# Altium schematic sheet SH6 - LOAD MONITORING 1.SchDoc: Load Monitoring 1
size B; CheckedBy: Lance Bantoto; Engineer: Cindy Li; Organization: UW Robotics; Address1: 200 University Avenue; Address2: Waterloo; Address3: Ontario; Address4: Canada N2L 3G6; DocumentNumber: 6; Revision: 2; SheetNumber: 6; SheetTotal: 10
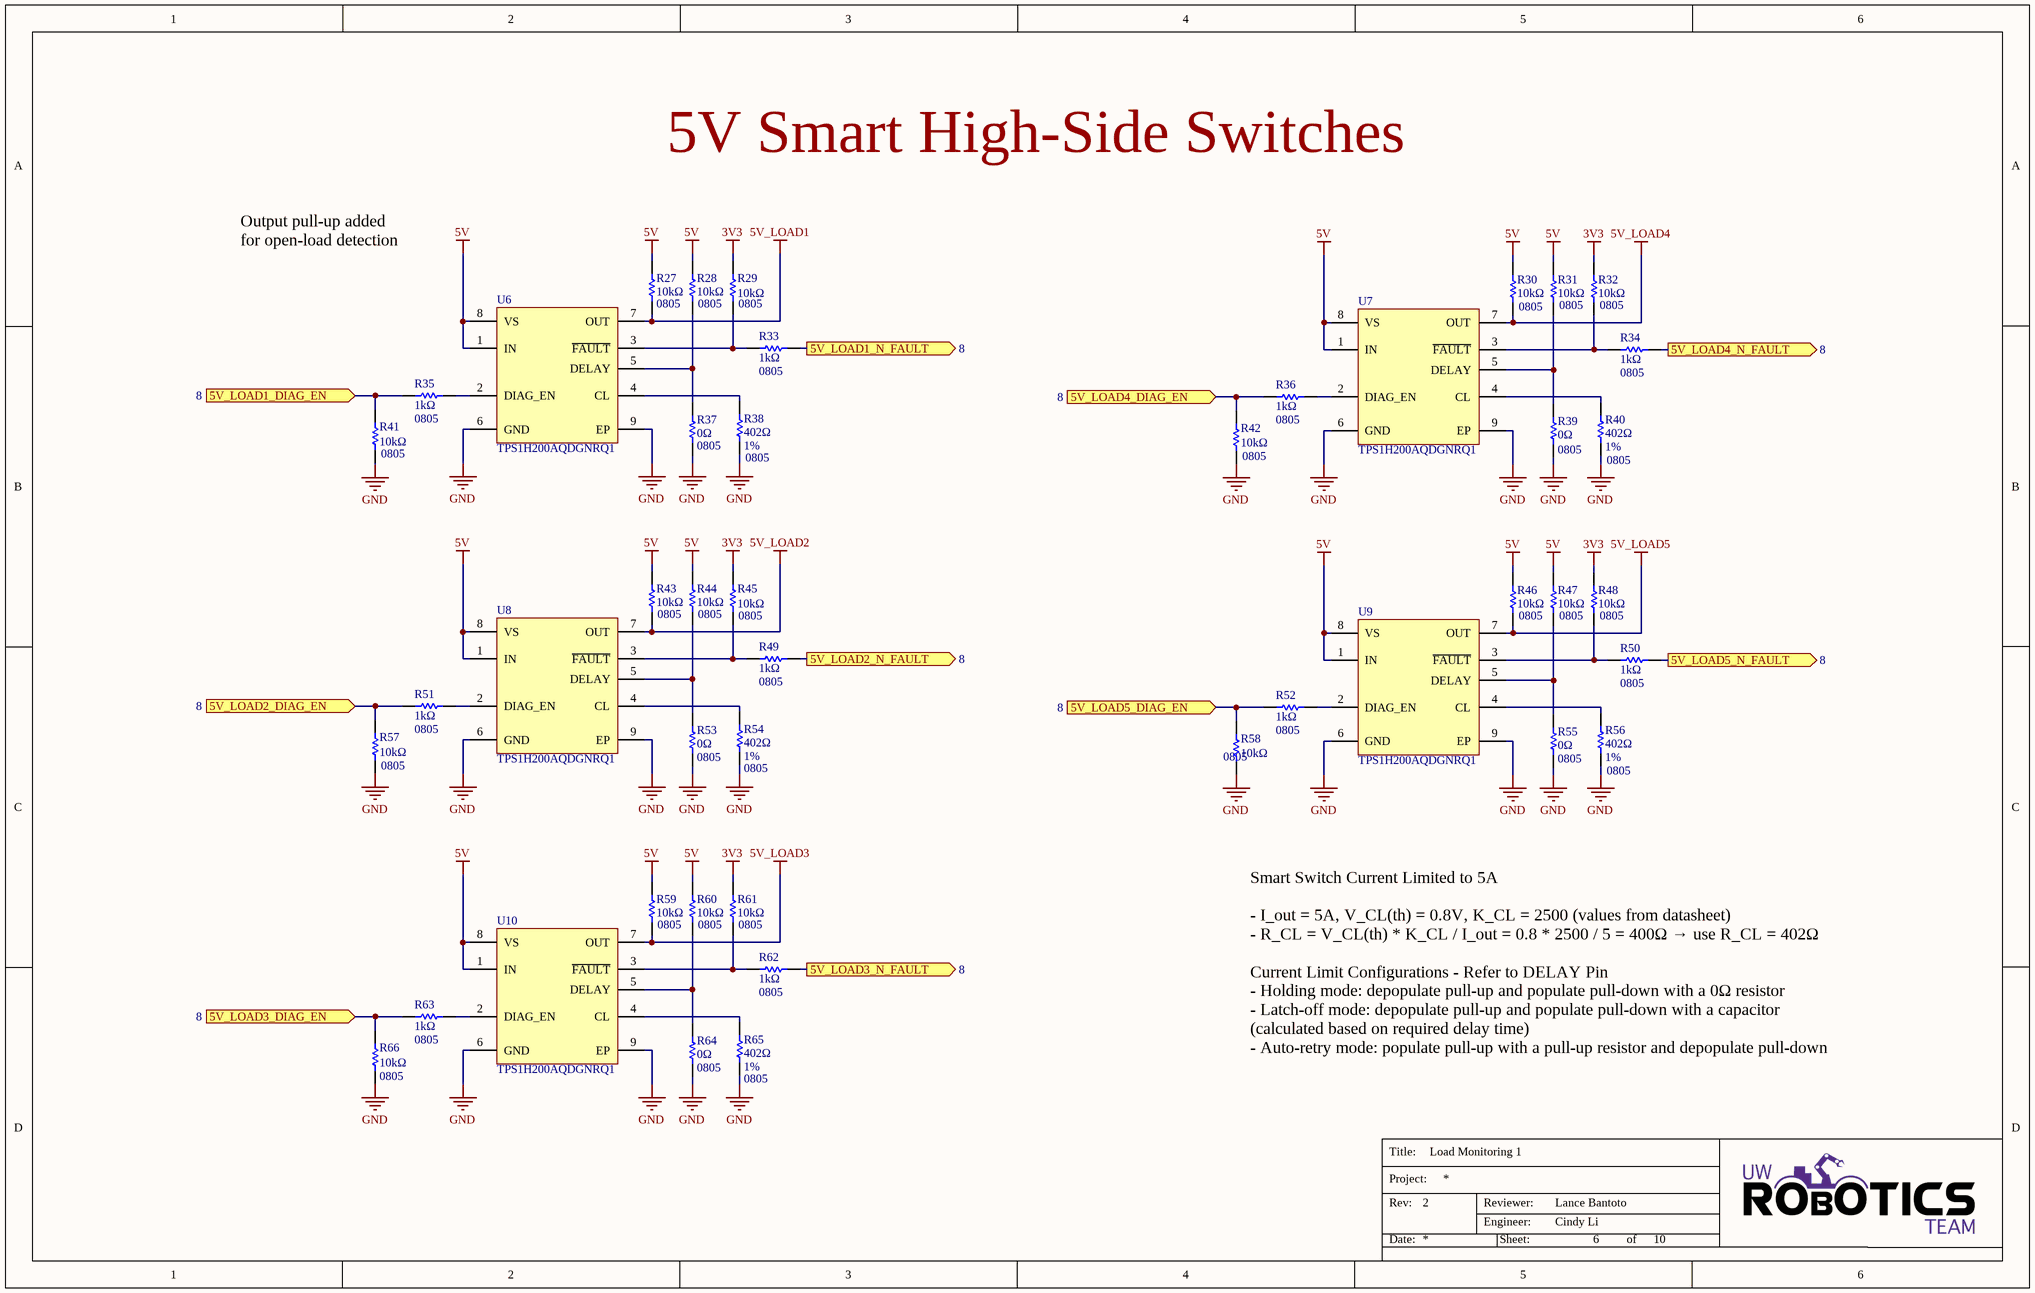
[diagram p0: SH6 - LOAD MONITORING 1.SchDoc]

## Parts
R27  value 10kΩ  Package/Footprint: 0805  [RESC0805]  (hidden comment: RES_10kΩ_0805_5%)
R28  value 10kΩ  Package/Footprint: 0805  [RESC0805]  (hidden comment: RES_10kΩ_0805_5%)
R29  value 10kΩ  Package/Footprint: 0805  [RESC0805]  (hidden comment: RES_10kΩ_0805_5%)
R30  value 10kΩ  Package/Footprint: 0805  [RESC0805]  (hidden comment: RES_10kΩ_0805_5%)
R31  value 10kΩ  Package/Footprint: 0805  [RESC0805]  (hidden comment: RES_10kΩ_0805_5%)
R32  value 10kΩ  Package/Footprint: 0805  [RESC0805]  (hidden comment: RES_10kΩ_0805_5%)
R33  Resistance: 1kΩ  Package/Footprint: 0805  [RESC0805]  (hidden comment: RES_1kΩ_0805_1%)
R34  Resistance: 1kΩ  Package/Footprint: 0805  [RESC0805]  (hidden comment: RES_1kΩ_0805_1%)
R35  Resistance: 1kΩ  Package/Footprint: 0805  [RESC0805]  (hidden comment: RES_1kΩ_0805_1%)
R36  Resistance: 1kΩ  Package/Footprint: 0805  [RESC0805]  (hidden comment: RES_1kΩ_0805_1%)
R37  value 0Ω  Package/Footprint: 0805  [RESC0805]  (hidden comment: RES_0Ω_0805)
R38  value 402Ω  Tolerance: 1%  Package/Footprint: 0805  [RESC0805]  (hidden comment: RES_402Ω_0805_1%)
R39  value 0Ω  Package/Footprint: 0805  [RESC0805]  (hidden comment: RES_0Ω_0805)
R40  value 402Ω  Tolerance: 1%  Package/Footprint: 0805  [RESC0805]  (hidden comment: RES_402Ω_0805_1%)
R41  value 10kΩ  Package/Footprint: 0805  [RESC0805]  (hidden comment: RES_10kΩ_0805_5%)
R42  value 10kΩ  Package/Footprint: 0805  [RESC0805]  (hidden comment: RES_10kΩ_0805_5%)
R43  value 10kΩ  Package/Footprint: 0805  [RESC0805]  (hidden comment: RES_10kΩ_0805_5%)
R44  value 10kΩ  Package/Footprint: 0805  [RESC0805]  (hidden comment: RES_10kΩ_0805_5%)
R45  value 10kΩ  Package/Footprint: 0805  [RESC0805]  (hidden comment: RES_10kΩ_0805_5%)
R46  value 10kΩ  Package/Footprint: 0805  [RESC0805]  (hidden comment: RES_10kΩ_0805_5%)
R47  value 10kΩ  Package/Footprint: 0805  [RESC0805]  (hidden comment: RES_10kΩ_0805_5%)
R48  value 10kΩ  Package/Footprint: 0805  [RESC0805]  (hidden comment: RES_10kΩ_0805_5%)
R49  Resistance: 1kΩ  Package/Footprint: 0805  [RESC0805]  (hidden comment: RES_1kΩ_0805_1%)
R50  Resistance: 1kΩ  Package/Footprint: 0805  [RESC0805]  (hidden comment: RES_1kΩ_0805_1%)
R51  Resistance: 1kΩ  Package/Footprint: 0805  [RESC0805]  (hidden comment: RES_1kΩ_0805_1%)
R52  Resistance: 1kΩ  Package/Footprint: 0805  [RESC0805]  (hidden comment: RES_1kΩ_0805_1%)
R53  value 0Ω  Package/Footprint: 0805  [RESC0805]  (hidden comment: RES_0Ω_0805)
R54  value 402Ω  Tolerance: 1%  Package/Footprint: 0805  [RESC0805]  (hidden comment: RES_402Ω_0805_1%)
R55  value 0Ω  Package/Footprint: 0805  [RESC0805]  (hidden comment: RES_0Ω_0805)
R56  value 402Ω  Tolerance: 1%  Package/Footprint: 0805  [RESC0805]  (hidden comment: RES_402Ω_0805_1%)
R57  value 10kΩ  Package/Footprint: 0805  [RESC0805]  (hidden comment: RES_10kΩ_0805_5%)
R58  value 10kΩ  Package/Footprint: 0805  [RESC0805]  (hidden comment: RES_10kΩ_0805_5%)
R59  value 10kΩ  Package/Footprint: 0805  [RESC0805]  (hidden comment: RES_10kΩ_0805_5%)
R60  value 10kΩ  Package/Footprint: 0805  [RESC0805]  (hidden comment: RES_10kΩ_0805_5%)
R61  value 10kΩ  Package/Footprint: 0805  [RESC0805]  (hidden comment: RES_10kΩ_0805_5%)
R62  Resistance: 1kΩ  Package/Footprint: 0805  [RESC0805]  (hidden comment: RES_1kΩ_0805_1%)
R63  Resistance: 1kΩ  Package/Footprint: 0805  [RESC0805]  (hidden comment: RES_1kΩ_0805_1%)
R64  value 0Ω  Package/Footprint: 0805  [RESC0805]  (hidden comment: RES_0Ω_0805)
R65  value 402Ω  Tolerance: 1%  Package/Footprint: 0805  [RESC0805]  (hidden comment: RES_402Ω_0805_1%)
R66  value 10kΩ  Package/Footprint: 0805  [RESC0805]  (hidden comment: RES_10kΩ_0805_5%)
U6  Manufacturer Part Number 1: TPS1H200AQDGNRQ1  [DGN0008G]  (hidden comment: TPS1H200A-Q1)
U7  Manufacturer Part Number 1: TPS1H200AQDGNRQ1  [DGN0008G]  (hidden comment: TPS1H200A-Q1)
U8  Manufacturer Part Number 1: TPS1H200AQDGNRQ1  [DGN0008G]  (hidden comment: TPS1H200A-Q1)
U9  Manufacturer Part Number 1: TPS1H200AQDGNRQ1  [DGN0008G]  (hidden comment: TPS1H200A-Q1)
U10  Manufacturer Part Number 1: TPS1H200AQDGNRQ1  [DGN0008G]  (hidden comment: TPS1H200A-Q1)

## Ports
5V_LOAD1_DIAG_EN (in, see 8), 5V_LOAD1_N_FAULT (out, see 8), 5V_LOAD2_DIAG_EN (in, see 8), 5V_LOAD2_N_FAULT (out, see 8), 5V_LOAD3_DIAG_EN (in, see 8), 5V_LOAD3_N_FAULT (out, see 8), 5V_LOAD4_DIAG_EN (in, see 8), 5V_LOAD4_N_FAULT (out, see 8), 5V_LOAD5_DIAG_EN (in, see 8), 5V_LOAD5_N_FAULT (out, see 8)

## Nets
3V3: R29.2 R32.2 R45.2 R48.2 R61.2
5V: R27.2 R28.2 R30.2 R31.2 R43.2 R44.2 R46.2 R47.2 R59.2 R60.2 U6.1(IN) U6.8(VS) U7.1(IN) U7.8(VS) U8.1(IN) U8.8(VS) U9.1(IN) U9.8(VS) U10.1(IN) U10.8(VS)
5V_LOAD1: R27.1 U6.7(OUT)
5V_LOAD2: R43.1 U8.7(OUT)
5V_LOAD3: R59.1 U10.7(OUT)
5V_LOAD4: R30.1 U7.7(OUT)
5V_LOAD5: R46.1 U9.7(OUT)
GND: R37.1 R38.1 R39.1 R40.1 R41.1 R42.1 R53.1 R54.1 R55.1 R56.1 R57.1 R58.1 R64.1 R65.1 R66.1 U6.6(GND) U6.9(EP) U7.6(GND) U7.9(EP) U8.6(GND) U8.9(EP) U9.6(GND) U9.9(EP) U10.6(GND) U10.9(EP)
5V_LOAD1_DIAG_EN: R35.1 R41.2 ; port 5V_LOAD1_DIAG_EN
5V_LOAD1_N_FAULT: R33.2 ; port 5V_LOAD1_N_FAULT
5V_LOAD2_DIAG_EN: R51.1 R57.2 ; port 5V_LOAD2_DIAG_EN
5V_LOAD2_N_FAULT: R49.2 ; port 5V_LOAD2_N_FAULT
5V_LOAD3_DIAG_EN: R63.1 R66.2 ; port 5V_LOAD3_DIAG_EN
5V_LOAD3_N_FAULT: R62.2 ; port 5V_LOAD3_N_FAULT
5V_LOAD4_DIAG_EN: R36.1 R42.2 ; port 5V_LOAD4_DIAG_EN
5V_LOAD4_N_FAULT: R34.2 ; port 5V_LOAD4_N_FAULT
5V_LOAD5_DIAG_EN: R52.1 R58.2 ; port 5V_LOAD5_DIAG_EN
5V_LOAD5_N_FAULT: R50.2 ; port 5V_LOAD5_N_FAULT
NetR28_1: R28.1 R37.2 U6.5(DELAY)
NetR29_1: R29.1 R33.1 U6.3(~{FAULT})
NetR31_1: R31.1 R39.2 U7.5(DELAY)
NetR32_1: R32.1 R34.1 U7.3(~{FAULT})
NetR35_2: R35.2 U6.2(DIAG_EN)
NetR36_2: R36.2 U7.2(DIAG_EN)
NetR38_2: R38.2 U6.4(CL)
NetR40_2: R40.2 U7.4(CL)
NetR44_1: R44.1 R53.2 U8.5(DELAY)
NetR45_1: R45.1 R49.1 U8.3(~{FAULT})
NetR47_1: R47.1 R55.2 U9.5(DELAY)
NetR48_1: R48.1 R50.1 U9.3(~{FAULT})
NetR51_2: R51.2 U8.2(DIAG_EN)
NetR52_2: R52.2 U9.2(DIAG_EN)
NetR54_2: R54.2 U8.4(CL)
NetR56_2: R56.2 U9.4(CL)
NetR60_1: R60.1 R64.2 U10.5(DELAY)
NetR61_1: R61.1 R62.1 U10.3(~{FAULT})
NetR63_2: R63.2 U10.2(DIAG_EN)
NetR65_2: R65.2 U10.4(CL)

## Notes on the sheet
- 5V Smart High-Side Switches
- Output pull-up added for open-load detection
- Smart Switch Current Limited to 5A
  - I_out = 5A, V_CL(th) = 0.8V, K_CL = 2500 (values from datasheet)
  - R_CL = V_CL(th) * K_CL / I_out = 0.8 * 2500 / 5 = 400Ω → use R_CL = 402Ω
  Current Limit Configurations - Refer to DELAY Pin
  - Holding mode: depopulate pull-up and populate pull-down with a 0Ω resistor
  - Latch-off mode: depopulate pull-up and populate pull-down with a capacitor (calculated based on required delay time)
  - Auto-retry mode: populate pull-up with a pull-up resistor and depopulate pull-down
- Title:
- Project:
- Date:
- Rev:
- Reviewer:
- Engineer:
- Sheet:
- of

## Library data of the parts
R27-R32 R41-R48 R57-R61 R66 = RES_10kΩ_0805_5%: RES 10K OHM 5% 1/8W 0805; Manufacturer 1: Panasonic Electronic Components; Manufacturer Part Number 1: ERJ-6GEYJ103V; Supplier Part Number 1: P10KACT-ND; Supplier 1: Digi-Key; LCSC Part #: C17414; Mounting Type: SMD
R33-R36 R49-R52 R62 R63 = RES_1kΩ_0805_1%: RES 1K OHM 1% 1/8W 0805; Manufacturer 1: Yageo; Manufacturer Part Number 1: RC0805FR-071KL; Supplier Part Number 1: 311-1.00KCRCT-ND; Supplier 1: Digi-Key; Tolerance: 1%; LCSC Part #: C17513; Mounting Type: SMD
R37 R39 R53 R55 R64 = RES_0Ω_0805: RES 0 OHM JUMPER 1/8W 0805; Manufacturer 1: Panasonic Electronic Components; Manufacturer Part Number 1: ERJ-6GEY0R00V; Supplier Part Number 1: P0.0ACT-ND; Supplier 1: Digi-Key; LCSC Part #: C17477; Mounting Type: SMD
R38 R40 R54 R56 R65 = RES_402Ω_0805_1%: RES 402 OHM 1% 1/8W 0805; Manufacturer 1: Stackpole Electronics Inc; Manufacturer Part Number 1: RMCF0805FT402R; Supplier 1: Digi-Key; Supplier Part Number 1: RMCF0805FT402RCT-ND; LCSC Part #: C17681; Mounting Type: SMD
U6-U10 = TPS1H200A-Q1: IC PWR DRIVER N-CHAN 1:1 8MSOP; Manufacturer 1: Texas Instruments; Output Type: N-Channel; Supply Voltage: 4V - 40V; Output Current (Max): 2.5A; Rds On (Typ): 200mOhm; Package/Footprint: 8-TSSOP; Supplier 1: Digi-Key; Supplier Part Number 1: 296-50416-1-ND; Operating Temperature: 40°C - 125°C; Mounting Type: SMD